# EAGLE design IFB-40001-R01 - I2C_Encoder (EAGLE 9.6.2)
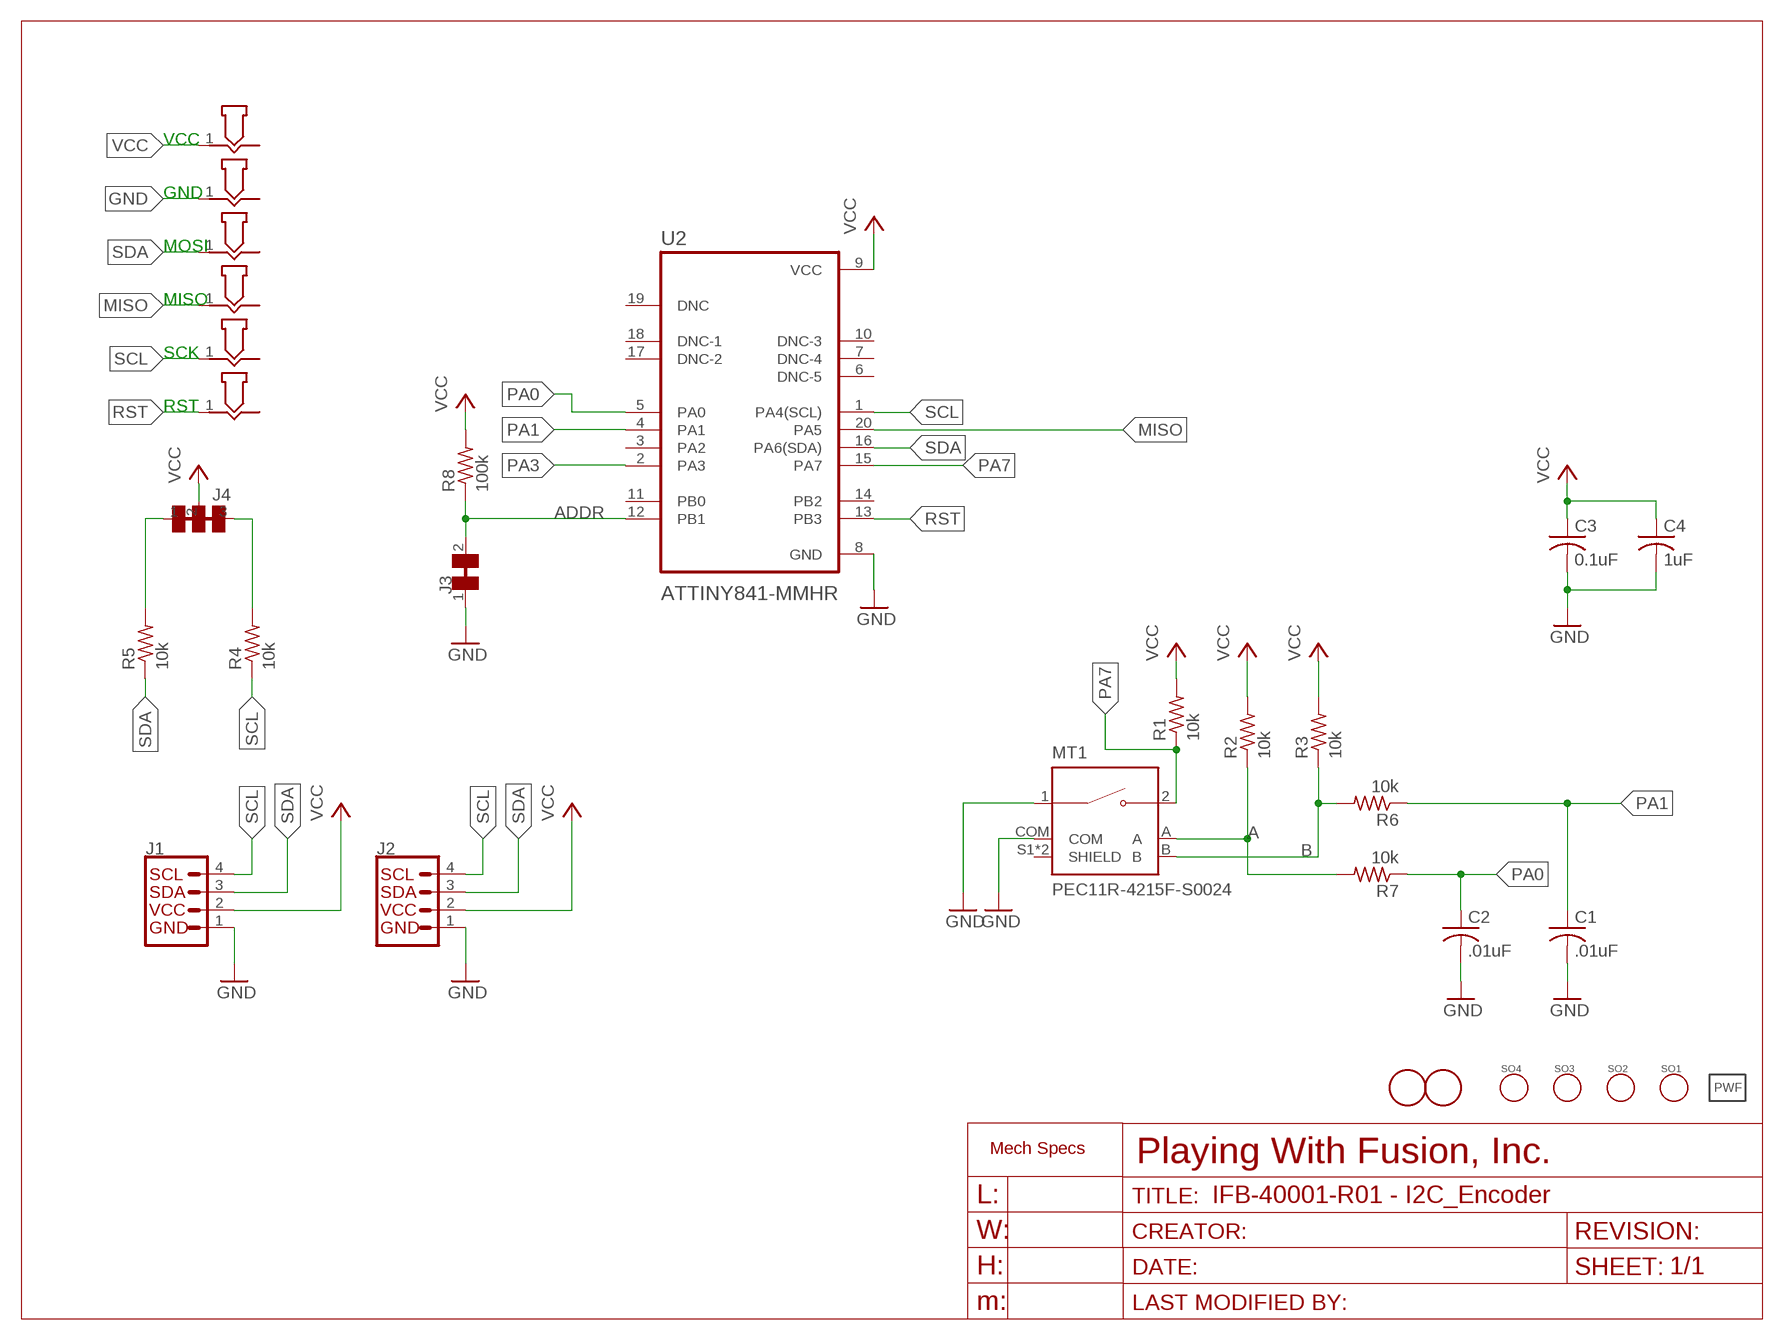
[diagram p0: schematic, sheet 1]

## Parts
C1  .01uF  C-USC0603K  [C0603K]
C2  .01uF  C-USC0603K  [C0603K]
C3  0.1uF  C-USC0603K  [C0603K]
C4  1uF  C-USC0603K  [C0603K]
GND  POGO_PAD  [P50_POGO_BOARD_CONTACT_12MIL]
J1  QWIIC_CONNECTORJS-1MM  [1X04_1MM_RA]
J2  QWIIC_CONNECTORJS-1MM  [1X04_1MM_RA]
J3  CUTTABLE_JUMPER  [SMT_CUTTABLE_JUMPER]
J4  CUT_JUMPER_2X  [SMT_2X_CUTTABLE_JUMPER]
LOGO1  PWF_LOGOPWF-5MM-SS  [LOGO_5MM_STEIN]
MISO  POGO_PAD  [P50_POGO_BOARD_CONTACT_12MIL]
MOSI  POGO_PAD  [P50_POGO_BOARD_CONTACT_12MIL]
MT1  PEC11R-4215F-S0024  [XDCR_PEC11R-4215F-S0024]
R1  10k  R-US_R0603  [R0603]
R2  10k  R-US_R0603  [R0603]
R3  10k  R-US_R0603  [R0603]
R4  10k  R-US_R0603  [R0603]
R5  10k  R-US_R0603  [R0603]
R6  10k  R-US_R0603  [R0603]
R7  10k  R-US_R0603  [R0603]
R8  100k  R-US_R0603  [R0603]
RST  POGO_PAD  [P50_POGO_BOARD_CONTACT_12MIL]
SCK  POGO_PAD  [P50_POGO_BOARD_CONTACT_12MIL]
SO1  STAND_OFFNO4_TIGHT  [STANDOFF_NO4_TIGHT]
SO2  STAND_OFFNO4_TIGHT  [STANDOFF_NO4_TIGHT]
SO3  STAND_OFFNO4_TIGHT  [STANDOFF_NO4_TIGHT]
SO4  STAND_OFFNO4_TIGHT  [STANDOFF_NO4_TIGHT]
U2  ATTINY841-MMHR  [QFN45P300X300X85-21N]
U$2  FIDUCIAL  [FIDUCIAL_1MM]
U$3  FIDUCIAL  [FIDUCIAL_1MM]
VCC  POGO_PAD  [P50_POGO_BOARD_CONTACT_12MIL]

## Nets
A: MT1.A R2.1 R7.2
ADDR: J3.2 R8.1 U2.12(PB1)
B: MT1.B R3.1 R6.2
GND: C1.2 C2.2 C3.2 C4.2 GND.1 J1.1(GND) J2.1(GND) J3.1 MT1.1 MT1.COM U2.8(GND)
MISO: MISO.1 U2.20(PA5)
N$1: J4.1 R5.2
N$2: J4.3 R4.2
PA0: C2.1 R7.1 U2.5(PA0)
PA1: C1.1 R6.1 U2.4(PA1)
PA3: U2.2(PA3)
PA7: MT1.2 R1.1 U2.15(PA7)
RST: RST.1 U2.13(PB3)
SCL: J1.4(SCL) J2.4(SCL) R4.1 SCK.1 U2.1(PA4(SCL))
SDA: J1.3(SDA) J2.3(SDA) MOSI.1 R5.1 U2.16(PA6(SDA))
VCC: C3.1 C4.1 J1.2(VCC) J2.2(VCC) J4.2 R1.2 R2.2 R3.2 R8.2 U2.9(VCC) VCC.1
Unconnected: MT1.S1(SHIELD) MT1.S2(SHIELD) U2.3(PA2) U2.6(DNC-5) U2.7(DNC-4) U2.10(DNC-3) U2.11(PB0) U2.14(PB2) U2.17(DNC-2) U2.18(DNC-1) U2.19(DNC)

## Notes on the sheet
- VCC
- GND
- MOSI
- MISO
- SCK
- RST

## Library data of the parts
C1-C4 = rcl:C-US: CAPACITOR, American symbol; SPICEPREFIX: C
GND MISO MOSI RST SCK VCC = PlayingWithFusion_Breakout-Lib:POGO_PAD
J1 J2 = SparkFun-Connectors:QWIIC_CONNECTOR: SparkFun I2C Standard Qwiic Connector An SMD 1mm pitch JST connector makes it easy and quick (get it? Qwiic?) to connect I2C devices to each other. The Qwiic system <http://www.sparkfun.com/qwiic> enables fast and solderless connection between popular platforms and various sensors and actuators. We carry 200mm <https://www.sparkfun.com/products/14204>, 100mm <https://www.sparkfun.com/products/14205>, 50mm <https://www.sparkfun.com/products/14206>, and breadboard friendly <https://www.sparkfun.com/products/14207> Qwiic cables. We also offer 10 pcs strips <https://www.sparkfun.com/products/14323> the SMD connectors.
J3 = PlayingWithFusion_Breakout-Lib:CUTTABLE_JUMPER
J4 = PlayingWithFusion_Breakout-Lib:CUT_JUMPER_2X
LOGO1 = PlayingWithFusion_Logo:PWF_LOGO
MT1 = PEC11R-4215F-S0024:PEC11R-4215F-S0024: Incremental Encoder, 12 Mm, Contact Rating 10 Ma - 5 Vdc Check availability <https://pricing.snapeda.com/parts/PEC11R-4215F-S0024/Bourns/view-part?ref=eda>; AVAILABILITY: In Stock; DESCRIPTION: Rotary Encoder Mechanical 24 Quadrature (Incremental) Vertical; MF: Bourns; MP: PEC11R-4215F-S0024; PACKAGE: None; PRICE: None; PURCHASE-URL: https://pricing.snapeda.com/search/part/PEC11R-4215F-S0024/?ref=eda
R1-R8 = rcl:R-US_: RESISTOR, American symbol; SPICEPREFIX: R
SO1-SO4 = PlayingWithFusion_Breakout-Lib:STAND_OFF: Stand Off This is the mechanical footprint for a #4 phillips button head screw. Use the keepout ring to avoid running the screw head into surrounding components. SKU : PRT-00447
U2 = ATTINY841-MMHR:ATTINY841-MMHR: None Check availability <https://pricing.snapeda.com/parts/ATTINY841-MMHR/Microchip/view-part?ref=eda>; AVAILABILITY: In Stock; DESCRIPTION: AVR AVR® ATtiny Microcontroller IC 8-Bit 16MHz 8KB (8K x 8) FLASH 20-VQFN (3x3); MF: Microchip; MP: ATTINY841-MMHR; PACKAGE: DFN-20 Microchip; PRICE: None; PURCHASE-URL: https://pricing.snapeda.com/search/part/ATTINY841-MMHR/?ref=eda
U$2 U$3 = PlayingWithFusion_Breakout-Lib:FIDUCIAL: For use by pick and place machines to calibrate the vision/machine, 1mm By microbuilder.eu

## Board
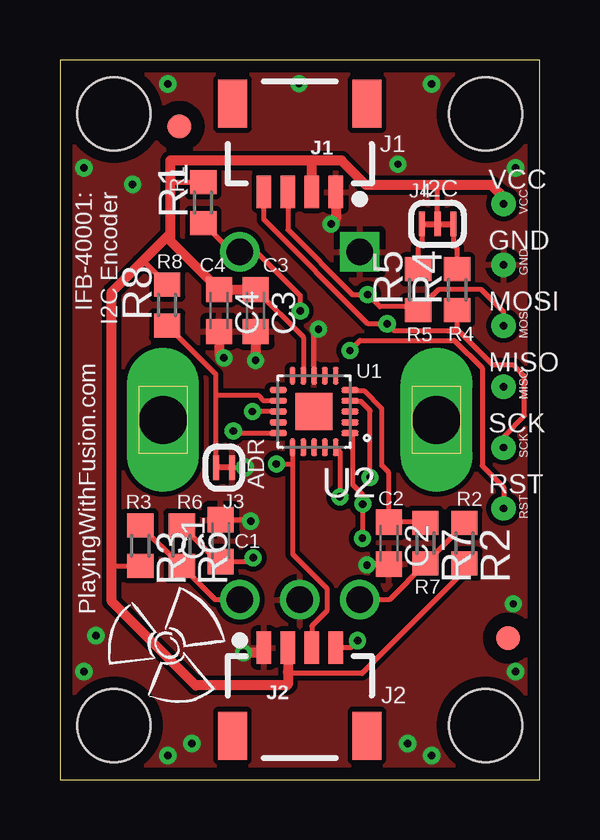
[diagram p1: board, top side]
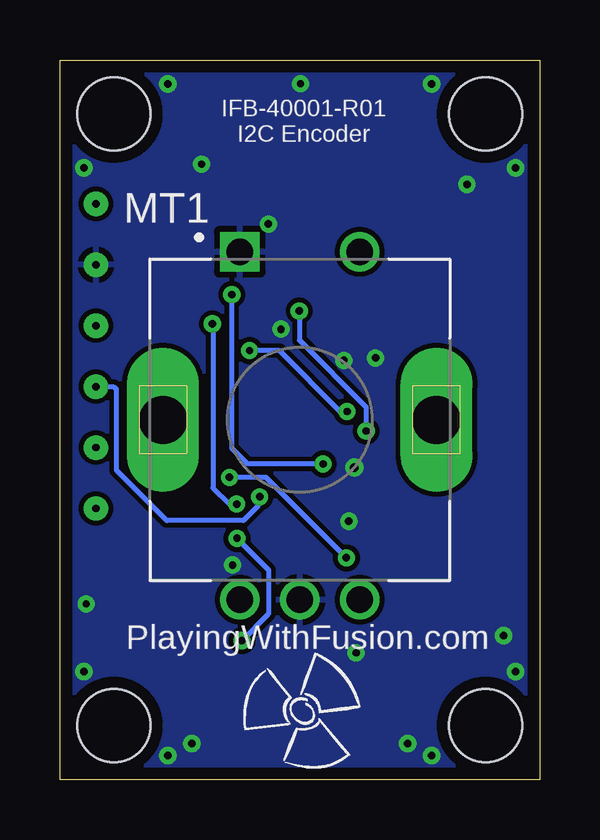
[diagram p2: board, bottom side, seen from below]

Size 20 x 30 mm. Coordinates in mm from the lower left corner, seen from the top.
Outline: 0,0 20,0 20,30 0,30 0,0
Copper layers (1*16): Top 0.035mm / dielectric 1.5mm / Bottom 0.035mm
Design rules "default *": minimum track width 8mil, minimum drill 12mil, track to track 8mil, track to pad 8mil, pad to pad 8mil, via to via 8mil, smd to smd 8mil, copper to edge 20mil, drill to drill 6mil, minimum pad ring 10mil, minimum via ring 8mil, stop-mask expansion 4mil, vias tented up to drill 17mil, thermal gap 10mil

### Footprints (pad centres in the part's own frame; a part is rotated, then mirrored left to right if it is on the bottom)
C0603K = smd 1.05 x 1.08: 1 -0.875,0; 2 0.875,0
P50_POGO_BOARD_CONTACT_12MIL = drill 0.305 pad 1.016: 1 0,0
1X04_1MM_RA = smd 0.6 x 1.35: 1 -1.5,0; 2 -0.5,0; 3 0.5,0; 4 1.5,0 | smd 1.2 x 2: NC1 2.8,-3.675; NC2 -2.8,-3.675
SMT_CUTTABLE_JUMPER = smd 0.254 x 1.016: 1 -0.33,0; 2 0.33,0
SMT_2X_CUTTABLE_JUMPER = smd 0.254 x 1.016: 1 -0.66,0; 2 0,0; 3 0.66,0
XDCR_PEC11R-4215F-S0024 = drill 1.1 square: 1 -2.5,7 | drill 1.1: 2 2.5,7; A -2.5,-7.5; B 2.5,-7.5; COM 0,-7.5 | drill 2 long: S1 -5.7,0; S2 5.7,0
R0603 = smd 1 x 1.1: 1 -0.85,0; 2 0.85,0
STANDOFF_NO4_TIGHT = hole 3.048: 0,0
QFN45P300X300X85-21N = smd 0.72 x 0.24: 1 -1.495,0.9; 2 -1.495,0.45; 3 -1.495,0; 4 -1.495,-0.45; 5 -1.495,-0.9; 11 1.495,-0.9; 12 1.495,-0.45; 13 1.495,0; 14 1.495,0.45; 15 1.495,0.9 | smd 0.24 x 0.72: 6 -0.9,-1.495; 7 -0.45,-1.495; 8 0,-1.495; 9 0.45,-1.495; 10 0.9,-1.495; 16 0.9,1.495; 17 0.45,1.495; 18 0,1.495; 19 -0.45,1.495; 20 -0.9,1.495 | smd 1.55 x 1.55: 21 0,0
FIDUCIAL_1MM = smd 1 x 1: 1 0,0

### Placement (x,y rotation side)
C1  6.71,9.96 90 top
C2  13.72,9.86 270 top
C3  8.16,19.56 270 top
C4  6.64,19.56 270 top
GND  18.5,21.46 0 top
J1  10,24.5 180 top
J2  10,5.5 0 top
J3  6.84,13 180 top
J4  15.75,23.16 0 top
LOGO1  4.44,5.61 0 top
LOGO2  PWF_LOGOPWF-6MM-SS  [LOGO_5MM_STEIN]  9.92,2.87 0 bottom
MISO  18.5,16.38 0 top
MOSI  18.5,18.92 0 top
MT1  10,15 0 bottom
R1  5.98,24.05 90 top
R2  16.87,9.86 270 top
R3  3.35,9.75 270 top
R4  16.56,20.42 90 top
R5  14.94,20.42 90 top
R6  5.08,9.75 270 top
R7  15.24,9.86 270 top
R8  4.47,19.78 90 top
RST  18.5,11.3 0 top
SCK  18.5,13.84 0 top
SO1  17.75,2.25 0 top
SO2  2.25,2.25 0 top
SO3  2.25,27.75 0 top
SO4  17.75,27.75 0 top
U2  10.6,15.34 180 top
U$2  4.98,27.23 0 top
U$3  18.69,5.89 0 top
VCC  18.5,24 0 top

### Tracks (layer width: path | path; a pad name or v marks a point on that pad's centre or on a via)
A
  Top 0.203: R2.1 16.87,10.63 R7.2 13.73,7.5 MT1.A
ADDR
  Top 0.203: J3.2 6.51,16 | 6.51,16 6.51,16.89 R8.1 | U2.12 8.51,15.79 8.3,16 6.51,16
B
  Top 0.203: R3.1 5.05,8.9 R6.2 6.48,7.5 MT1.B
GND  (via drill 0.3, 0.35)
  Top 0.203: U2.8 10.6,18.59 v10.78,18.78 | v7.96,10.77 7.89,10.83 C1.2 | J3.1 v7.72,13.01 | C2.2 12.84,8.98 v12.8,8.94
  Top 0.406: v6.84,17.58 6.64,17.78 C4.2 | C3.2 v8.16,17.48 | v11.31,23.16 11.5,23.36 J1.1 | J2.1 8.28,5.28 v7.65,5.28
  other vias: 1,25.5 3.02,24.81 4.5,29 9.97,29.01 15.5,29 14.09,25.66 19,25.5 1.5,6 1,4.5 4.5,1 5.5,1.5 15.5,1 14.5,1.5 19,4.5 18.91,7.32
  pour Bottom: 0,30 0,0 20,0 20,30
  pour Top: 0,30 0,0 20,0 20,30
MISO  (via drill 0.3)
  Top 0.203: U2.20 11.67,13.67 v11.67,11.79
  Bottom 0.203: v11.67,11.79 11.74,11.71 11.74,11.4 12.35,10.8 15.55,10.8 17.64,12.89 17.64,16.26 17.76,16.38 MISO.1
N$1
  Top 0.203: J4.1 15.09,22.3 14.94,22.15 R5.2
N$2
  Top 0.203: J4.3 16.41,22.3 16.56,22.15 R4.2
PA0
  Top 0.203: U2.5 12.12,16.22 12.67,16.22 13.41,15.47 13.41,13.11 13.72,12.8 C2.1 15.21,10.73 R7.1
PA1  (via drill 0.3)
  Top 0.203: R6.1 6.6,9.08 C1.1 7.89,9.08 v8.06,9.25 | U2.4 12.12,15.77 12.54,15.77 12.94,15.38 v12.94,12.6
  Bottom 0.203: v8.06,9.25 11.41,12.6 v12.94,12.6
PA7  (via drill 0.3)
  Top 0.203: R1.1 7.18,22 MT1.2 8.2,22 10.02,20.18 v10.02,19.54 | v7.23,14.53 7.23,14.44 U2.15
  Bottom 0.203: v10.02,19.54 10.02,18.32 7.23,15.53 v7.23,14.53
RST  (via drill 0.3)
  Top 0.203: U2.13 v8.03,15.34 | RST.1 18.5,12.18 17.61,13.08 17.61,17.15 16.45,18.3 12.51,18.3 v12.09,17.88
  Bottom 0.203: v8.03,15.34 8.31,15.34 10.85,17.88 v12.09,17.88
SCL  (via drill 0.3)
  Top 0.203: U2.1 12.2,14.33 12.2,12.29 12.61,11.89 12.61,11.48 | 12.61,11.48 v12.63,11.48 | 12.61,11.48 v12.61,10.06 | v12.41,5.79 12.12,5.5 J2.4 | J1.4 8.5,23.34 12.85,19 v13.65,19 13.93,18.71 16.62,18.71 | SCK.1 18.5,14.3 19.37,15.17 19.37,16.83 18.93,17.27 18.05,17.27 16.62,18.71 | R4.1 16.56,18.77 16.62,18.71
  Bottom 0.203: v13.65,19 13.62,18.97 13.62,12.16 12.94,11.48 v12.63,11.48 | v12.61,10.06 11.29,8.74 11.29,6.91 v12.41,5.79
SDA  (via drill 0.3)
  Top 0.203: U2.16 9.7,13.16 | 9.7,13.16 9.7,9.4 11.13,7.97 11.13,7.03 10.5,6.4 J2.3 | v9.02,13.16 9.7,13.16 | J1.3 9.5,22.92 12.2,20.22 v12.83,20.22 13.34,19.71 14.8,19.71 R5.1 15.79,20.42 17.58,20.42 18.5,19.5 MOSI.1
  Bottom 0.203: v12.83,20.22 12.83,13.82 12.17,13.16 v9.02,13.16
VCC
  Top 0.203: C3.1 10.15,18.45 U2.9 | R1.2 5.96,24.89 4.6,24.89 | R2.2 16.87,8.69 12.6,4.43 9.55,4.43 9.51,4.47 | R3.2 3.34,8.89 2.17,8.89 | R8.2 3.57,21.53 3.36,21.53 | J4.2 15.75,24.79
  Top 0.406: J1.2 10.5,25.81 | 10.5,25.81 4.6,25.81 4.6,24.89 4.6,22.77 | 4.6,22.77 4.6,22.46 C4.1 C3.1 | J2.2 9.51,4.47 9.51,3.96 9.47,3.92 5.66,3.92 2.17,7.42 2.17,8.89 2.17,20.33 3.36,21.53 4.6,22.77 | VCC.1 18.5,24.27 17.98,24.79 15.75,24.79 12.76,24.79 11.74,25.81 10.5,25.81

### Text on the board
tPlace: J1 | IFB-40001: / I2C Encoder | R1 | I2C | VCC | R8 | C4 | C3 | GND | R5 | R4 | MOSI | PlayingWithFusion.com | U1 | MISO | SCK | ADR | R3 | R6 | C2 | R2 | RST | C1 | R7 | J2
bPlace: IFB-40001-R01 / I2C Encoder | PlayingWithFusion.com